# EAGLE design sensorring_withflex_v3 (EAGLE 6.3)
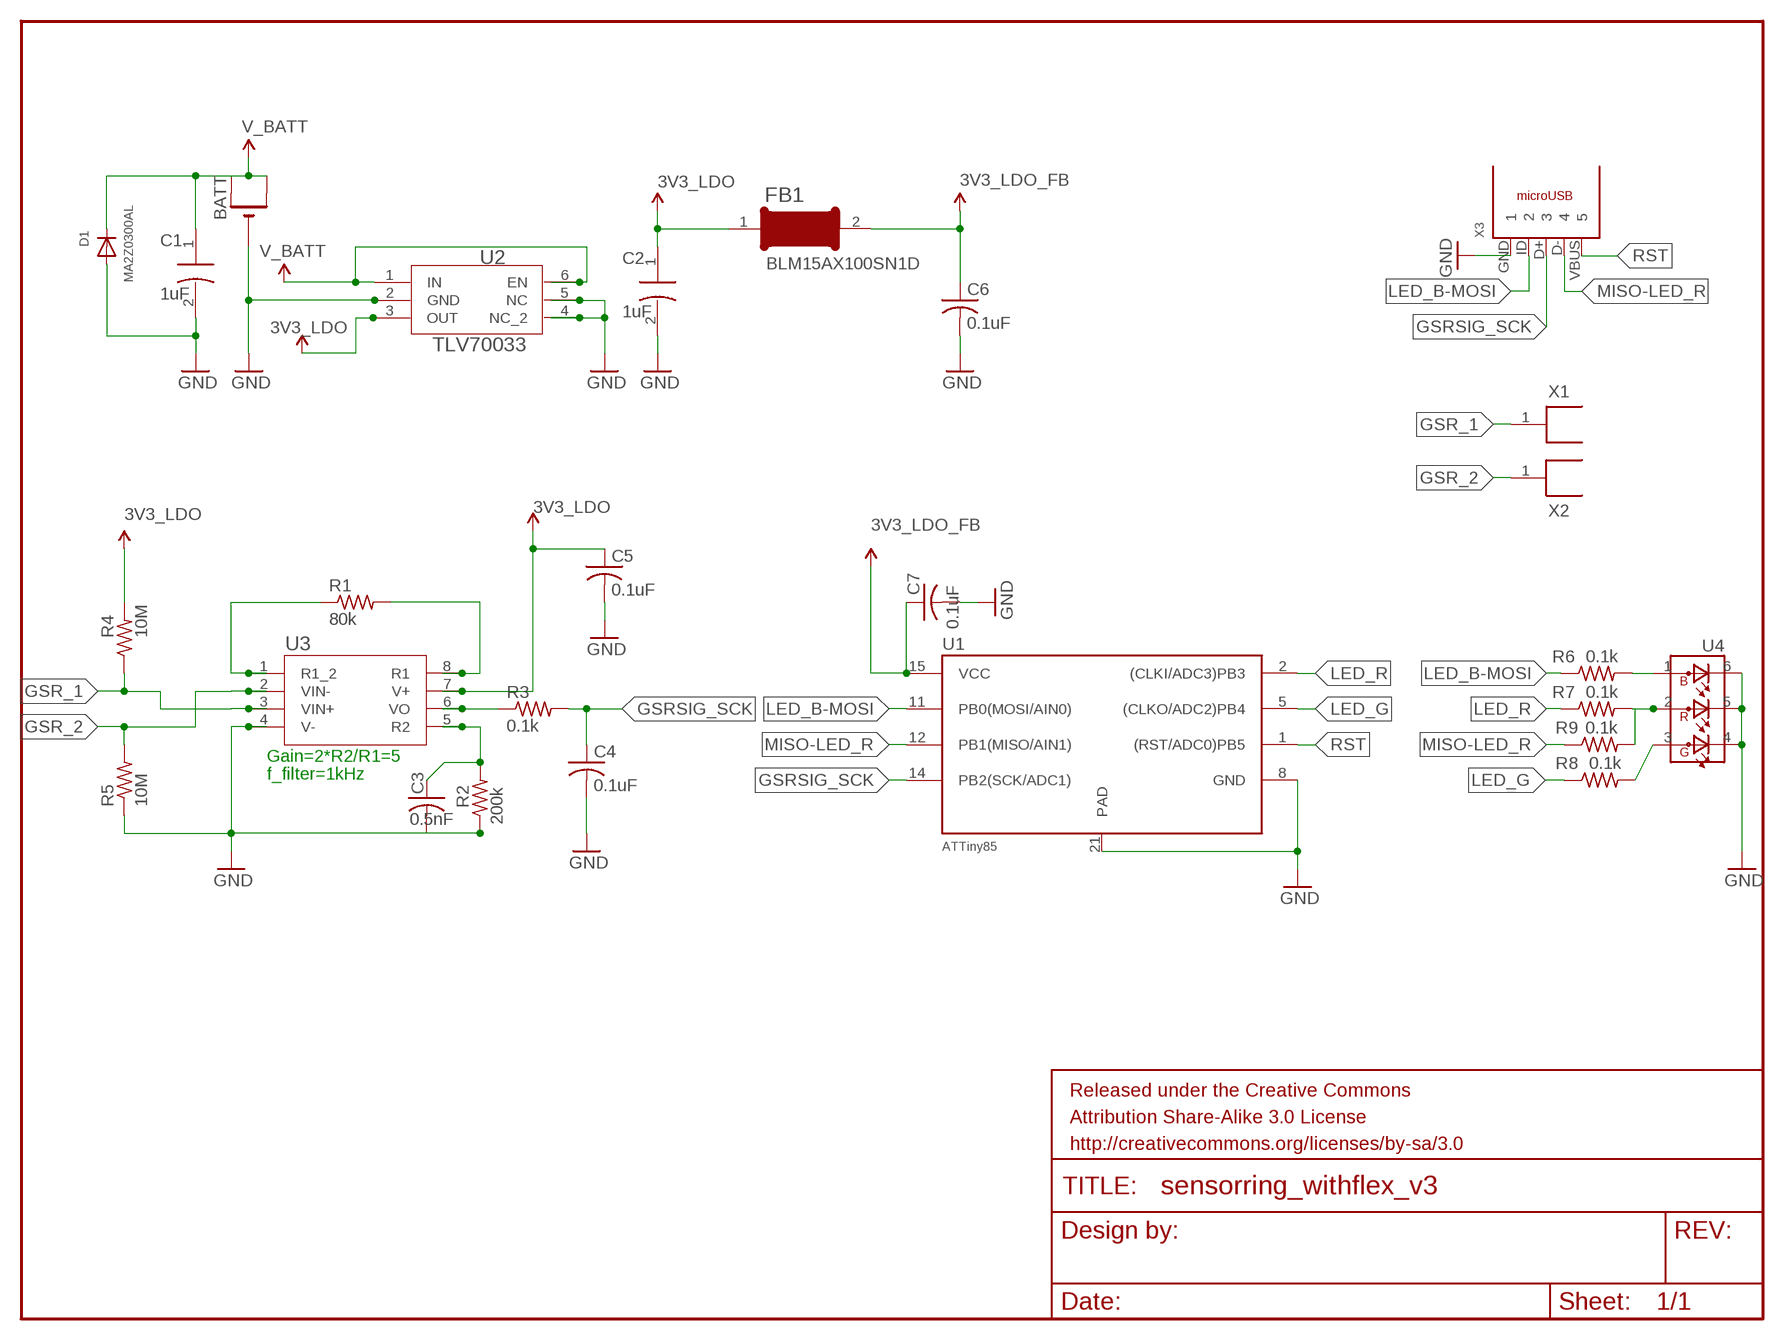
[diagram p0: schematic, sheet 1]

## Parts
BATT  CR2032SMT  [CR2032-SMD]
C1  1uF  C_1005  [C1005]
C2  1uF  C_1005  [C1005]
C3  0.5nF  C-USC0402  [C0402]
C4  0.1uF  C-USC0402  [C0402]
C5  0.1uF  C-USC0402  [C0402]
C6  0.1uF  C-USC0402  [C0402]
C7  0.1uF  C-USC0402  [C0402]
D1  MA2Z0300AL  DIODESOD-323F  [SOD-323F]
FB1  BLM15AX100SN1D  FERRITE  [0402]
FRAME1  FRAME-LETTER  [CREATIVE_COMMONS]
R1  80k  R-US_R0402  [R0402]
R2  200k  R-US_R0402  [R0402]
R3  0.1k  R-US_R0402  [R0402]
R4  10M  R-US_R0402  [R0402]
R5  10M  R-US_R0402  [R0402]
R6  0.1k  R-US_R0402  [R0402]
R7  0.1k  R-US_R0402  [R0402]
R8  0.1k  R-US_R0402  [R0402]
R9  0.1k  R-US_R0402  [R0402]
U1  ATTiny85  ATTINY85  [20M1]
U2  TLV70033  TLV70028_DSE_6  [DSE6]
U3  INA337_DGK_8  [DGK8]
U4  PICOLED-RGB-1MMX1MM5  [PICOLED-1MM_1MM5]
X1  GSR_FLEX  [GSR_FLEX_LEAD]
X2  GSR_FLEX  [GSR_FLEX_LEAD]
X3  USB-MICRO-B  [USB-MICROB]

## Nets
3V3_LDO: C2.1 C5.1 FB1.1 R4.2 U2.3(OUT) U3.7(V+) ; supply symbol labelled 3V_LDO
3V3_LDO_FB: C6.1 C7.1 FB1.2 U1.15(VCC) ; supply symbol labelled 3V_LDO, 3V_LDO_FB
GND: BATT.- C1.2 C2.2 C3.2 C4.2 C5.2 C6.2 C7.2 D1.A R2.1 R5.1 U1.8(GND) U1.21(PAD) U2.2(GND) U2.4(NC_2) U2.5(NC) U3.4(V-) U4.4(A_G) U4.5(A_R) U4.6(A_B) X3.GND
GSR_1: R4.1 U3.3(VIN+) X1.1
GSR_2: R5.2 U3.2(VIN-) X2.1
GSRSIG_SCK: C4.1 R3.2 U1.14(PB2(SCK/ADC1)) X3.D+
LED_B-MOSI: R6.1 U1.11(PB0(MOSI/AIN0)) X3.ID
LED_G: R8.1 U1.5((CLKO/ADC2)PB4)
LED_R: R7.1 U1.2((CLKI/ADC3)PB3)
MISO-LED_R: R9.1 U1.12(PB1(MISO/AIN1)) X3.D-
N$2: R3.1 U3.6(VO)
N$3: R6.2 U4.1(C_B)
N$4: R1.2 U3.8(R1)
N$5: R1.1 U3.1(R1_2)
N$8: R8.2 U4.3(C_G)
N$9: C3.1 R2.2 U3.5(R2)
N$14: R7.2 R9.2 U4.2(C_R)
RST: U1.1((RST/ADC0)PB5) X3.VBUS
V_BATT: BATT.+$1(+) BATT.+$2(+1) C1.1 D1.C U2.1(IN) U2.6(EN)

## Notes on the sheet
- Gain=2*R2/R1=5
- f_filter=1kHz

## Library data of the parts
BATT = adafruit:CR2032; OC_NEWARK: unknown
C1 C2 = dps_library:C_1005; MPN: C1005X5R0J105M050BB; OC_NEWARK: 90R7581
C3 = adafruit:C-US: CAPACITOR, American symbol; OC_NEWARK: unknown
C4-C7 = adafruit:C-US: CAPACITOR, American symbol; MPN: C1005X5R1H104K050BB; OC_NEWARK: 04X3219
D1 = adafruit:DIODE: Diode SMADIODE - SMA Surface Mount Package 20V 1A Schottky Diode Digikey: 641-1014-6-ND DO-1N4148 - Through Hole Small Current Diode SOD-123 20V 1 A (.5mV Vf) Schottky Diode - Digikey: MBRX120TPMSCT-ND SOD-323 10V 570mA (.38mV Vf, 3ns) Schottky Diode - Digikey: ZLLS410CT-ND SOD-523 30V 30mA Schottky Diode (RB751S-40TE61) - Digikey: RB751S-40TE61CT-ND SOT23-R/W - SOT23 Package (R = Solder Paste/Reflow Ovens, W = Hand-Soldering) BAT54Film 40V 300mA - Digikey: 497-7162-1-ND
FB1 = dps_library:FERRITE: Ferrite Bead Eg - http://www.digikey.com/product-detail/en/BLM15AX100SN1D/490-5437-1-ND/2256881; OC_NEWARK: unknown
FRAME1 = SparkFun-Aesthetics:FRAME-LETTER: Schematic Frame Standard 8.5x11 US Letter frame; OC_NEWARK: unknown
R1 = adafruit:R-US_: RESISTOR, American symbol; MF: VISHAY/DALE; MPN: CRCW040240K2FKED; OC_NEWARK: 52K7049
R2 = adafruit:R-US_: RESISTOR, American symbol; MF: VISHAY/DALE; MPN: CRCW0402200KFKED; OC_NEWARK: 52K6825
R3 R6-R8 = adafruit:R-US_: RESISTOR, American symbol; MPN: CH0402-100RGF; OC_NEWARK: 15R0734
R4 R5 = adafruit:R-US_: RESISTOR, American symbol; MF: VISHAY/DALE; MPN: CRCW04021M00FKED; OC_NEWARK: 52K6593
R9 = adafruit:R-US_: RESISTOR, American symbol
U1 = dps_library:ATTINY85: ATtiny25/45/85 Atmel 8-bit uC Symbol Note NC pins - 3,4,6,7,9,10,13,16,17,18,19,20.; MPN: ATTINY84-15MZ; OC_NEWARK: 68T3780
U2 = dps_library:TLV70028_DSE_6; DATASHEETURL: http://www.ti.com/lit/gpn/TLV70028; DESCRIPTION: 200mA, Low IQ, Low Dropout Regulator for Portables; FAMILY_NAME: SINGLE CHANNEL LDO; GENERIC_PART_NUMBER: TLV70028; INDUSTRY_STD_PKG_TYPE: WSON; MANUFACTURER: Texas Instruments; MANUFACTURER_PART_NUMBER: tlv70028_dse_6; MPN: TLV70033DSET; OC_NEWARK: 50R8015; PACKAGE_DESIGNATOR: DSE; PIN_COUNT: 6; VENDOR: Texas Instruments
U3 = dps_library:INA337_DGK_8; DATASHEETURL: http://www.ti.com/lit/gpn/INA337; DESCRIPTION: Wide-Temperature, Precision Instrumentation Amplifier; FAMILY_NAME: SINGLE SUPPLY; GENERIC_PART_NUMBER: INA337; INDUSTRY_STD_PKG_TYPE: MSOP; MANUFACTURER: Texas Instruments; MANUFACTURER_PART_NUMBER: ina337_dgk_8; OC_NEWARK: unknown; PACKAGE_DESIGNATOR: DGK; PIN_COUNT: 8; VENDOR: Texas Instruments
U4 = dps_library:PICOLED-RGB-1MMX1MM5: Rohm Semi PICO LED RGB 1mm x 1.5mm, 5mA current; OC_NEWARK: unknown
X1 X2 = dps_library:GSR_FLEX: GSR FLEX PCB CONNECTOR This is one lead for connecting Flex PCB with one connector; OC_NEWARK: unknown
X3 = dps_library:USB-MICRO-B: MICRO USB Type B Hirose Electronics - Datasheet http://www.farnell.com/datasheets/81390.pdf; OC_NEWARK: unknown

## Net classes
0 default: width 0.127 mm, drill 0.127 mm, clearance 0.127 mm

## Board
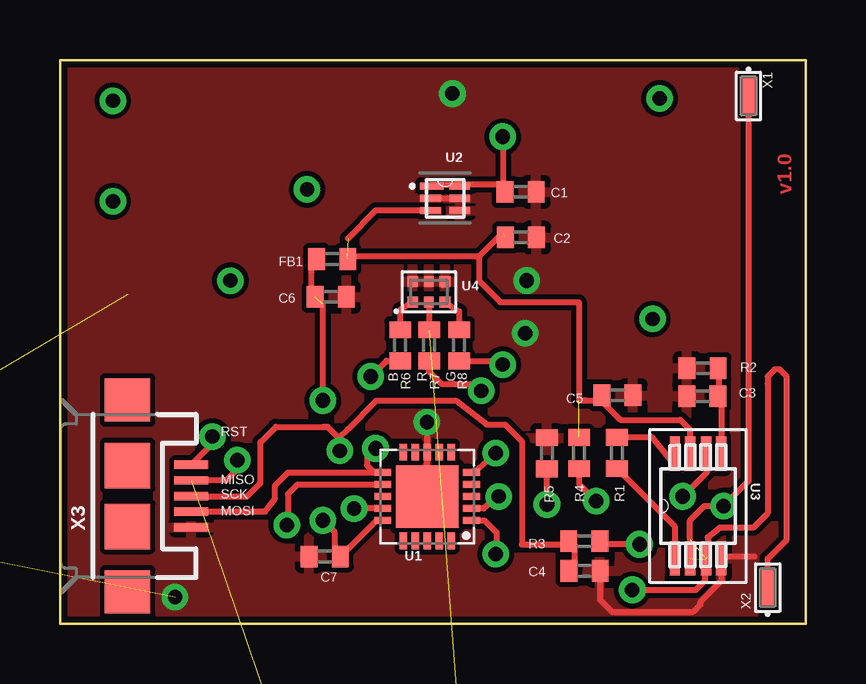
[diagram p1: board, top side]
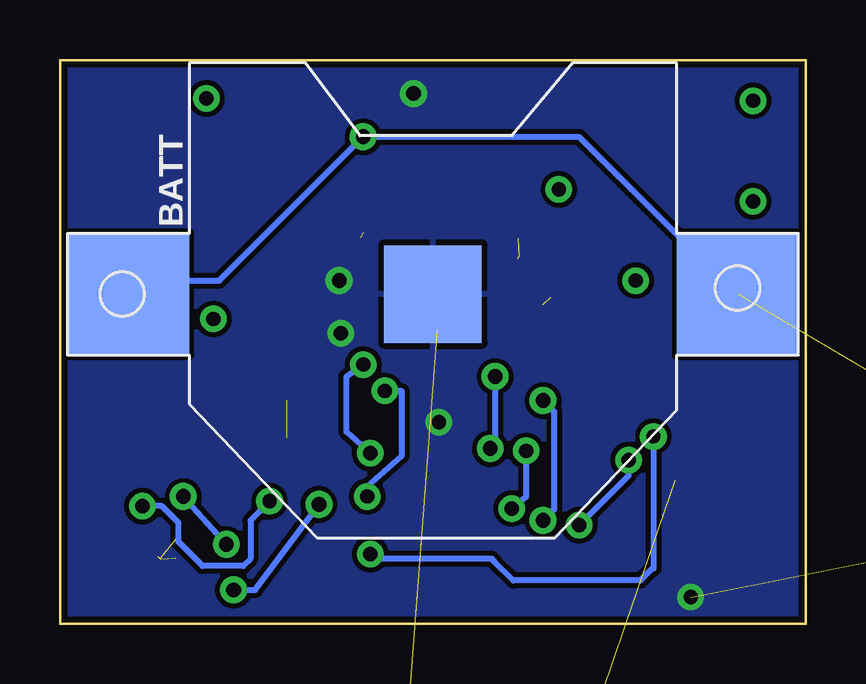
[diagram p2: board, bottom side, seen from below]

Size 31.1 x 23.5 mm. Coordinates in mm from the lower left corner, seen from the top.
Outline: 0,0 31.1,0 31.1,23.5 0,23.5 0,0
Copper layers (1*16): Top 0.035mm / dielectric 1.5mm / Bottom 0.035mm
Design rules "SparkFun *": minimum track width 8mil, minimum drill 20mil, track to track 8mil, track to pad 8mil, pad to pad 7mil, via to via 8mil, smd to smd 7mil, copper to edge 10mil, drill to drill 8mil, minimum pad ring 12mil, minimum via ring 10mil, stop-mask expansion 4mil, vias tented up to drill 25mil, thermal gap 10mil

### Footprints (pad centres in the part's own frame; a part is rotated, then mirrored left to right if it is on the bottom)
CR2032-SMD = smd 5.08 x 5.08: +$1 -12.7,0; +$2 12.7,0 | smd 4.064 x 4.064: - 0,0
C1005 = smd 0.7 x 0.9: 1 -0.65,0; 2 0.65,0
C0402 = smd 0.7 x 0.9: 1 -0.65,0; 2 0.65,0
SOD-323F = smd 1 x 0.8: A -1,0; C 1,0
0402 = smd 0.7 x 0.9: 1 -0.65,0; 2 0.65,0
R0402 = smd 0.7 x 0.9: 1 -0.65,0; 2 0.65,0
20M1 = smd 0.7 x 0.3: 1 -1.85,1; 2 -1.85,0.5; 3 -1.85,0; 4 -1.85,-0.5; 5 -1.85,-1; 11 1.85,-1; 12 1.85,-0.5; 13 1.85,0; 14 1.85,0.5; 15 1.85,1 | smd 0.3 x 0.7: 6 -1,-1.85; 7 -0.5,-1.85; 8 0,-1.85; 9 0.5,-1.85; 10 1,-1.85; 16 1,1.85; 17 0.5,1.85; 18 0,1.85; 19 -0.5,1.85; 20 -1,1.85 | smd 2.6 x 2.6: 21 0,0
DSE6 = smd 0.965 x 0.305: 1 -0.559,0.508 | smd 0.864 x 0.305: 2 -0.61,0; 3 -0.61,-0.508; 4 0.61,-0.508; 5 0.61,0; 6 0.61,0.508
DGK8 = smd 1.422 x 0.432: 1 -2.184,0.965; 2 -2.184,0.33; 3 -2.184,-0.33; 4 -2.184,-0.965; 5 2.184,-0.965; 6 2.184,-0.33; 7 2.184,0.33; 8 2.184,0.965
PICOLED-1MM_1MM5 = smd 0.45 x 0.45: 1 -0.675,-0.425; 3 0.675,-0.425; 4 0.675,0.425; 6 -0.675,0.425 | smd 0.4 x 0.45: 2 0,-0.425; 5 0,0.425
GSR_FLEX_LEAD = smd 1.5 x 0.5: 1 0,0
USB-MICROB = smd 1.4 x 0.35: D+ -2.65,0; D- -2.65,-0.65; GND -2.65,1.3; ID -2.65,0.65; VBUS -2.65,-1.3 | smd 1.9 x 1.8: MT1 0,-4; MT2 0,4 | smd 1.9 x 1.9: P$1 0,-1.27; P$2 0,1.27

### Placement (x,y rotation side)
BATT  15.55,13.73 0 bottom
C1  19.2,18 0 top
C2  19.22,16.1 0 top
C3  26.78,9.48 180 top
C4  21.87,2.2 0 top
C5  23.24,9.52 0 top
C6  11.29,13.62 0 top
C7  11.04,2.8 180 top
D1  -10.16,5.08 90 top  (outside the outline)
FB1  11.35,15.2 180 top
FRAME1  29.72,-4.7 180 top  (outside the outline)
R1  23.22,7.11 90 top
R2  26.79,10.65 0 top
R3  21.86,3.44 180 top
R4  21.64,7.11 90 top
R5  20.3,7.1 270 top
R6  14.18,11.6 90 top
R7  15.39,11.6 90 top
R8  16.64,11.6 90 top
R9  17.78,-27.94 0 top  (outside the outline)
U1  15.31,5.3 180 top
U2  16.06,17.73 0 top
U3  26.6,4.9 90 top
U4  15.38,13.83 0 top
X1  28.7,22 270 top
X2  29.5,1.5 90 top
X3  2.82,5.32 180 top

### Tracks (layer width: path | path; a pad name or v marks a point on that pad's centre or on a via)
3V3_LDO  (4 unrouted)
  Top 0.254: U2.3 13.16,17.22 12,16.06 | 21.64,9.3 21.63,13.4 18.36,13.4 17.46,14.3 17.46,15.3 | 21.64,9.3 21.96,9.3 | 21.96,9.3 22.46,9.3 C5.1 | 18.46,16.3 17.46,15.3 | 21.96,9.3 21.64,9.3 | 17.46,15.3 11.96,15.3 | U3.7 26.27,7.59 26.26,7.6 26.26,8.1 25.86,8.5 23.36,8.5 22.56,9.3 21.96,9.3 | 21.64,9.3 21.96,9.3
3V3_LDO_FB  (via drill 0.61)  (1 unrouted)
  Top 0.254: C6.1 10.46,13.3 10.46,15.3 FB1.2 | U1.15 13.19,4.3 C7.1 11.46,2.8 11.46,3.8 v10.96,4.3 | v10.96,9.3 10.96,13.3
  Bottom 0.254: v10.96,9.3 10.5,8.84 10.5,5.2 10.5,4.76 v10.96,4.3
GND  (via drill 0.6, 0.61)  (1 unrouted)
  Top 0.254: 15.96,14.1 16.04,14.26 | U1.21 U1.8 v15.3,8.4 | U2.2 U2.5 | 28.96,2.8 27.65,2.8 U3.4 27.6,2.68 27.6,1.8 26.7,0.9 26.7,0.8 26.4,0.5 23,0.5 22.52,0.98 C4.2
  other vias: 19.46,14.3 16.36,22.1 4.8,1.1 19.4,12.1
  pour Top: -0.7,24.2 31.9,24.2 32,-0.9 -0.6,-0.9
  pour Bottom: -0.5,23.7 31.3,23.7 31.4,-0.2 -0.4,-0.2
GSR_1  (via drill 0.6)  (1 unrouted)
  Top 0.254: R4.1 21.64,5.82 v22.36,5.1 | X1.1 28.7,5.94 v27.66,4.9 26.86,4.9 26.33,4.37 26.27,4.31 26.27,3.51 | 26.96,2.3 U3.3
  Bottom 0.254: v22.36,5.1 23.16,4.3 23.16,2.7 23.46,2.4 25.16,2.4 26.16,3.4 26.16,4.2 26.86,4.9 v27.66,4.9
GSR_2  (via drill 0.61)  (2 unrouted)
  Top 0.254: v23.86,1.4 25.16,1.4 26.5,1.4 26.9,1.8 26.9,2.69 | v20.3,4.97 R5.2 | 27,2.79 27,3.6 27.5,4 28.9,4 29.5,4.6 29.5,10 29.5,10.3 29.8,10.6 30,10.6 30.3,10.3 30.3,3.5 29.5,2.7 X2.1
  Bottom 0.254: v20.3,4.97 22.96,1.4 v23.86,1.4
GSRSIG_SCK  (via drill 0.6)
  Top 0.254: 21.46,3.3 21.46,2.3 C4.1 | 21.46,3.3 R3.2 21.46,3.3 | 21.46,3.3 19.26,3.3 19.26,7.6 18.56,8.3 17.8,8.3 16.5,9.3 15.9,9.3 13.2,9.3 12,8.1 11.66,7.76 11.66,7.7 | X3.D+ 6.06,5.3 7.8,5.3 8.36,5.86 8.36,7.56 8.4,7.6 9,8.2 11,8.2 11.1,8.2 11.16,8.2 11.66,7.7 | U1.14 v12.26,4.8 | v11.66,7.2 11.66,7.7
  Bottom 0.254: v12.26,4.8 11.66,5.3 v11.66,7.2
LED_B-MOSI  (via drill 0.61)
  Top 0.254: X3.ID 7.13,4.67 8.56,4.67 8.96,5.2 8.96,5.76 9.5,6.3 12.46,6.3 13.1,6.3 | 13.1,6.3 U1.11 13.1,6.3 | 14.16,10.8 R6.1 13.61,10.95 v12.96,10.3 | v13.16,7.3 13,7.3 12.8,7.1 12.8,6.6 13.1,6.3
  Bottom 0.254: v12.96,10.3 12.96,7.5 v13.16,7.3
LED_G  (via drill 0.6)
  Top 0.254: R8.1 18.21,10.95 v18.46,10.8 | v18.16,7.1 17.26,6.3 U1.5
  Bottom 0.254: v18.16,7.1 19.16,8 19.16,10.3 v18.46,10.8
LED_R  (via drill 0.6)
  Top 0.254: v18.29,5.3 17.66,4.8 U1.2 | R7.1 15.39,10.51 15.9,10 16.4,10 17.26,10 v17.56,9.7
  Bottom 0.254: v18.29,5.3 18.29,5.71 16.86,7 16.86,9.69 v17.56,9.69 v17.56,9.7
MISO-LED_R  (via drill 0.6)  (1 unrouted)
  Top 0.254: 5.5,6 X3.D- 6.93,5.97 7.4,6.44 v7.4,6.82 | v9.46,4.1 9.5,4.14 9.5,5.4 9.9,5.8 9.94,5.8 12.78,5.8 12.8,5.8 U1.12
  Bottom 0.254: v9.46,4.1 7.4,6.16 v7.4,6.82
N$1  (via drill 0.6)
  other vias: 2.2,21.8
N$2  (via drill 0.61)
  Top 0.254: v24.16,3.3 22.46,3.3 R3.1 | v25.96,5.3 26.96,6.3 26.96,6.8 U3.6
  Bottom 0.254: v25.96,5.3 v24.16,3.3
N$3
  Top 0.254: U4.1 14.18,13.08 R6.2
N$4
  Top 0.254: R1.2 24.7,7.76 25.46,6.8 U3.8
N$5
  Top 0.254: R1.1 25.64,4.04 U3.1
N$6  (via drill 0.6)
  other vias: 10.3,18.1
N$8
  Top 0.254: U4.3 16.64,13.02 R8.2
N$9
  Top 0.254: 27.46,9.3 27.46,10.3 R2.2 | 27.46,9.3 C3.1 | 27.46,9.3 27.57,9.2 U3.5
N$10  (via drill 0.6)
  other vias: 7.1,14.3
N$11  (via drill 0.6)
  other vias: 2.2,17.6
N$12  (via drill 0.6)
  other vias: 25,21.9
N$13  (via drill 0.6)
  other vias: 24.7,12.7
N$14  (1 unrouted)
  Top 0.254: U4.2 R7.2
RST  (via drill 0.6)
  Top 0.254: X3.VBUS 6.36,7.51 v6.36,7.8 | U1.1 17.7,4.3 18.1,3.9 18.2,3.8 18.2,2.94 v18.16,2.9
  Bottom 0.254: v6.36,7.8 6.36,2.3 6.36,2.34 6.9,1.8 12.2,1.8 13,2.6 13.1,2.7 17.96,2.7 v18.16,2.9
V_BATT  (via drill 0.61)  (1 unrouted)
  Top 0.254: v18.46,20.3 18.46,18.3 | 18.46,18.3 C1.1 18.46,18.3 | 16.46,18.3 15.46,18.3 U2.1 | 16.46,18.3 U2.6 16.46,18.3 | 18.46,18.3 16.46,18.3
  Bottom 0.254: BATT.+$1 27.46,14.3 24.46,14.3 v18.46,20.3 9.46,20.3 3.46,14.3 BATT.+$2

### Text on the board
Top: v1.0
tPlace: B | R | G | RST | MISO | SCK | MOSI
tDocu: Deba Saha